# Altium schematic sheet power.SchDoc
size A3
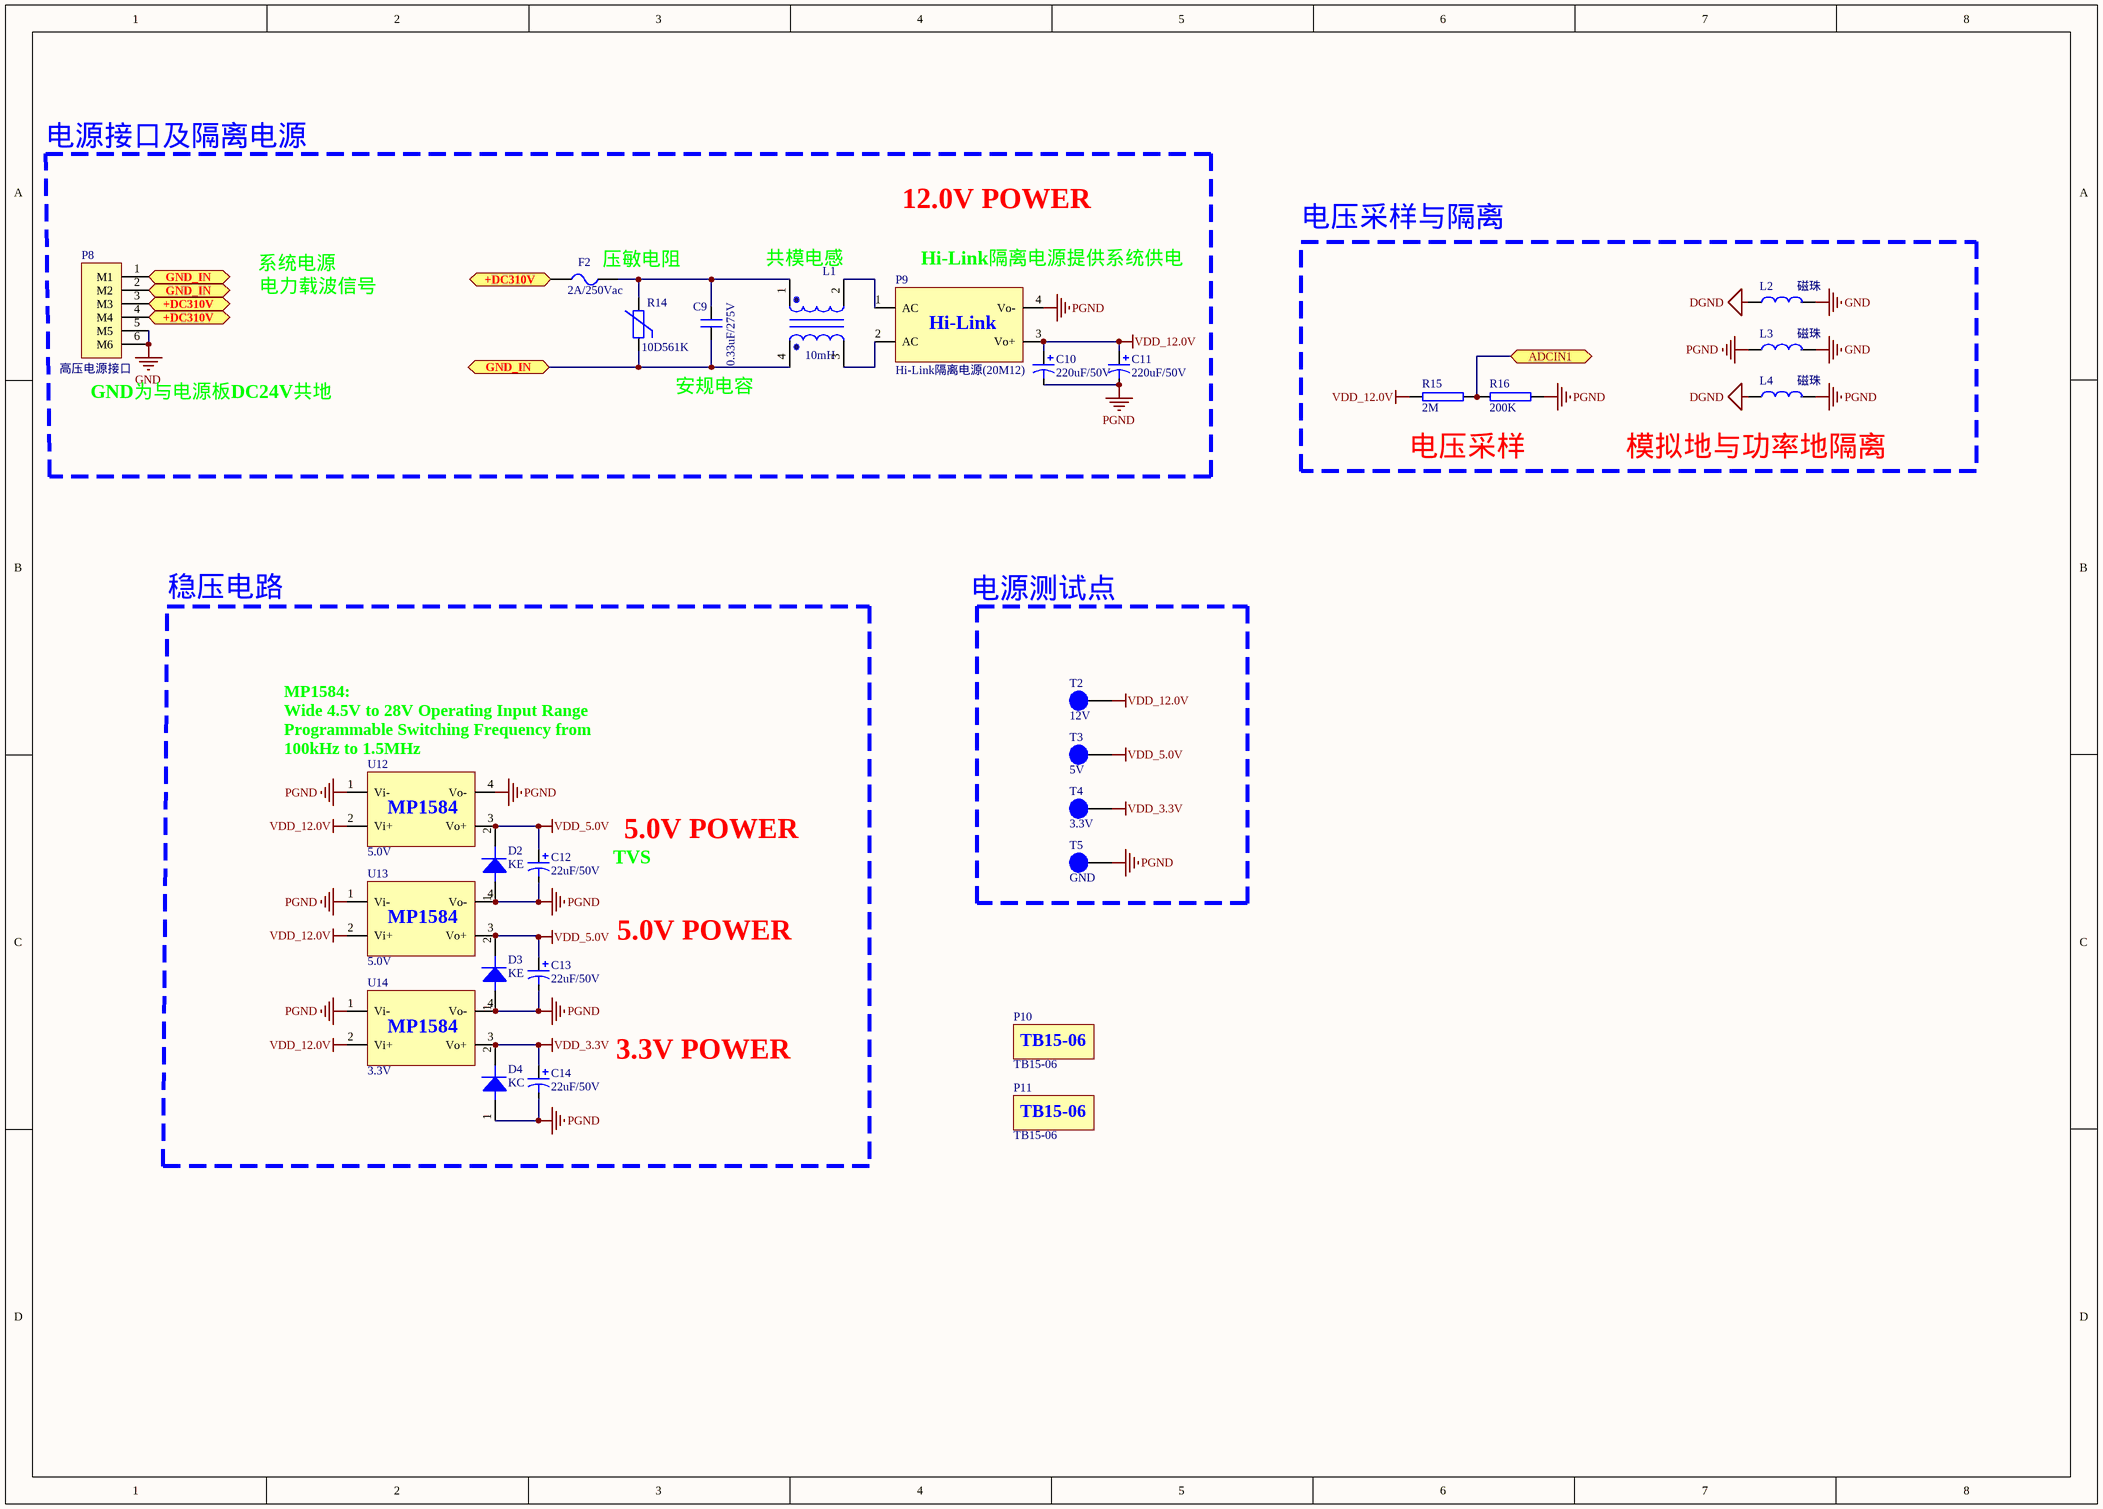
[diagram p0: power.SchDoc]

## Parts
C9  0.33uF/275V  [CX 15*18*11]
C10  220uF/50V  [CAP 5.0*10*12.5-H - GD]
C11  220uF/50V  [CAP 5.0*10*12.5-H - GD]
C12  22uF/50V  [CM D(6.3*5.4)]
C13  22uF/50V  [CM D(6.3*5.4)]
C14  22uF/50V  [CM D(6.3*5.4)]
D2  KE  [SMA]
D3  KE  [SMA]
D4  KC  [SMA]
F2  2A/250Vac  [FU 5x20]
L1  10mH  [T12x6x4]
L2  磁珠  [1206L]
L3  磁珠  [1206L]
L4  磁珠  [1206L]
P8  高压电源接口  [PH2.0WS-6P]
P9  Hi-Link隔离电源(20M12)  [HLK-20M24]
P10  TB15-06  [TB1506]
P11  TB15-06  [TB1506]
R14  10D561K  [VDR 10D-4.5]
R15  2M  [0805R]
R16  200K  [0805R]
T2  12V  [HEADER 1]
T3  5V  [HEADER 1]
T4  3.3V  [HEADER 1]
T5  GND  [HEADER 1]
U12  5.0V  [MP1584电源模块]
U13  5.0V  [MP1584电源模块]
U14  3.3V  [MP1584电源模块]

## Ports
+DC310V, +DC310V (bidir), ADCIN1, GND_IN

## Nets
DGND: L2.1 L4.1
GND: L2.2 L3.2 P8.5(M5) P8.6(M6)
PGND: C10.2 C11.2 C12.2 C13.2 C14.2 D2.1 D3.1 D4.1 L3.1 L4.2 P9.4(Vo-) R16.2 T5.1 U12.1(Vi-) U12.4(Vo-) U13.1(Vi-) U13.4(Vo-) U14.1(Vi-) U14.4(Vo-)
VDD_3.3V: C14.1 D4.2 T4.1 U14.3(Vo+)
VDD_5.0V: C12.1 C13.1 D2.2 D3.2 T3.1 U12.3(Vo+) U13.3(Vo+)
VDD_12.0V: C10.1 C11.1 P9.3(Vo+) R15.1 T2.1 U12.2(Vi+) U13.2(Vi+) U14.2(Vi+)
+DC310V: F2.1 P8.3(M3) P8.4(M4) ; port +DC310V
ADCIN1: R15.2 R16.1 ; port ADCIN1
GND_IN: C9.1 L1.4 P8.1(M1) P8.2(M2) R14.1 ; port GND_IN
NetC9_2: C9.2 F2.2 L1.1 R14.2
NetL1_2: L1.2 P9.1(AC)
NetL1_3: L1.3 P9.2(AC)

## Notes on the sheet
- 电源接口及隔离电源
- 12.0V POWER
- 电压采样与隔离
- 系统电源
- 电力载波信号
- (near F2) 压敏电阻
- (near L1) 共模电感
- (near P9) Hi-Link隔离电源提供系统供电
- (near P8) GND为与电源板DC24V共地
- 安规电容
- 电压采样
- (near L4) 模拟地与功率地隔离
- 稳压电路
- 电源测试点
- (near U12) MP1584:
  Wide 4.5V to 28V Operating Input Range
  Programmable Switching Frequency from
  100kHz to 1.5MHz
- 5.0V POWER
- TVS
- 3.3V POWER
- (in symbol HILINK-24V) Hi-Link
- (in symbol MP1584电源模块) MP1584

## Library data of the parts
C9 = Cap2: 安规电容
C10-C14 = Cap3: 直插极性电容
D2-D4 = Diode: 二极管
F2 = Fuse: 保险丝
L1 = 共模电感
L2-L4 = L: 电感
P8 = 接线端子-6PIN: 6PIN
P9 = HILINK-24V
R14 = 压敏电阻
R15 R16 = R1
T2-T5 = 测试点
U12-U14 = MP1584电源模块